# EAGLE schematic Motherboard_1 (EAGLE 9.2.0)
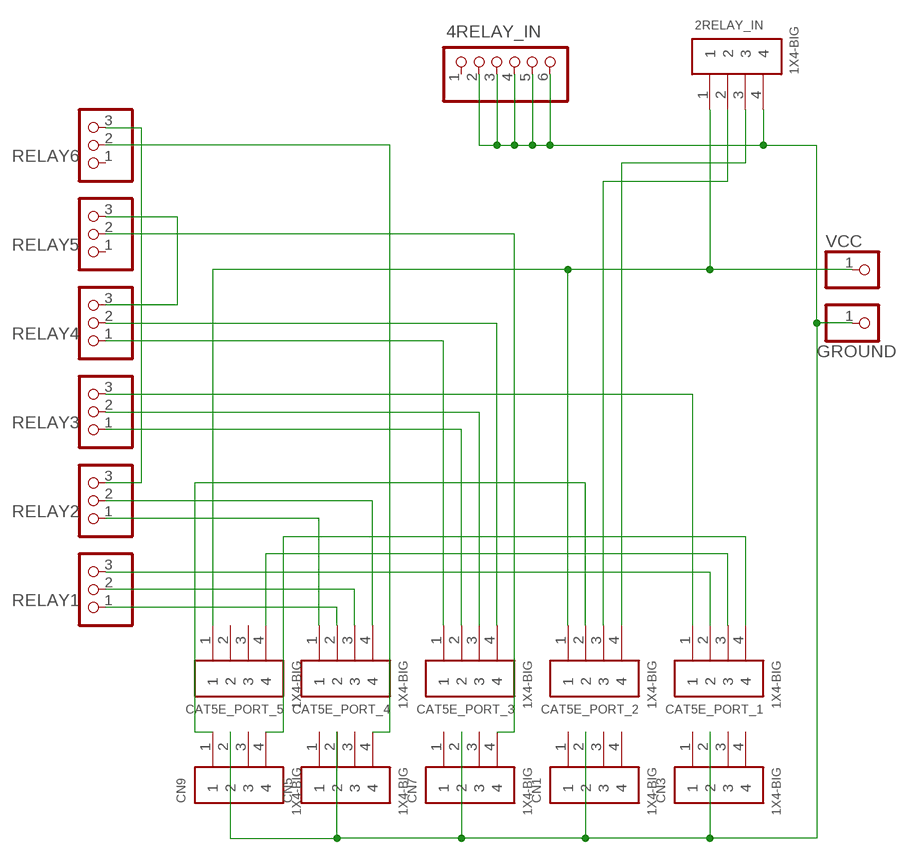
[diagram p0: schematic, sheet 1]

## Parts
2RELAY_IN  1X4-BIG  [1X04-BIG]
4RELAY_IN  PINHD-1X6  [1X06]
CAT5E_PORT_1  1X4-BIG  [1X04-BIG]
CAT5E_PORT_2  1X4-BIG  [1X04-BIG]
CAT5E_PORT_3  1X4-BIG  [1X04-BIG]
CAT5E_PORT_4  1X4-BIG  [1X04-BIG]
CAT5E_PORT_5  1X4-BIG  [1X04-BIG]
CN1  1X4-BIG  [1X04-BIG]
CN3  1X4-BIG  [1X04-BIG]
CN5  1X4-BIG  [1X04-BIG]
CN7  1X4-BIG  [1X04-BIG]
CN9  1X4-BIG  [1X04-BIG]
GROUND  PINHD-1X1  [1X01]
RELAY1  PINHD-1X3  [1X03]
RELAY2  PINHD-1X3  [1X03]
RELAY3  PINHD-1X3  [1X03]
RELAY4  PINHD-1X3  [1X03]
RELAY5  PINHD-1X3  [1X03]
RELAY6  PINHD-1X3  [1X03]
VCC  PINHD-1X1  [1X01]

## Nets
N$11: CAT5E_PORT_4.1 RELAY2.1
N$12: CAT5E_PORT_4.2 RELAY1.1
N$13: CAT5E_PORT_4.3 RELAY1.2
N$14: CAT5E_PORT_4.4 RELAY2.2
N$15: CN5.4 RELAY6.2
N$16: 2RELAY_IN.3 CAT5E_PORT_2.4
N$17: CAT5E_PORT_3.1 RELAY4.1
N$18: CAT5E_PORT_3.2 RELAY3.1
N$19: CAT5E_PORT_3.4 RELAY4.2
N$20: RELAY2.3 RELAY6.3
N$21: RELAY4.3 RELAY5.3
N$22: CN7.4 RELAY5.2
N$23: CAT5E_PORT_1.1 RELAY3.3
N$24: CAT5E_PORT_3.3 RELAY3.2
N$25: CAT5E_PORT_1.2 RELAY1.3
N$26: CAT5E_PORT_1.3 CAT5E_PORT_5.4
N$27: CAT5E_PORT_1.4 CN9.4
N$28: CAT5E_PORT_2.2 CN9.1
N$29: 2RELAY_IN.1 CAT5E_PORT_2.1 CAT5E_PORT_5.1 VCC.1
N$30: 2RELAY_IN.4 4RELAY_IN.2 4RELAY_IN.3 4RELAY_IN.4 4RELAY_IN.5 4RELAY_IN.6 CN1.2 CN3.2 CN5.2 CN7.2 CN9.2 GROUND.1
N$31: 2RELAY_IN.2 CAT5E_PORT_2.3
Unconnected: 4RELAY_IN.1 CAT5E_PORT_5.2 CAT5E_PORT_5.3 CN1.1 CN1.3 CN1.4 CN3.1 CN3.3 CN3.4 CN5.1 CN5.3 CN7.1 CN7.3 CN9.3 RELAY5.1 RELAY6.1

## Library data of the parts
2RELAY_IN CAT5E_PORT_1-CAT5E_PORT_5 CN1 CN3 CN5 CN7 CN9 = adafruit:1X4: 4-pin connector
4RELAY_IN = adafruit:PINHD-1X6: PIN HEADER
GROUND VCC = adafruit:PINHD-1X1: Pin header 1x1 for 0.1" spacing With round pins
RELAY1-RELAY6 = adafruit:PINHD-1X3: PIN HEADER

## Net classes
0 default: width 0.762 mm, drill 0.254 mm, clearance 0.025 mm